# Altium schematic sheet Controle.SchDoc
size A4; SheetNumber: 2; SheetTotal: 4
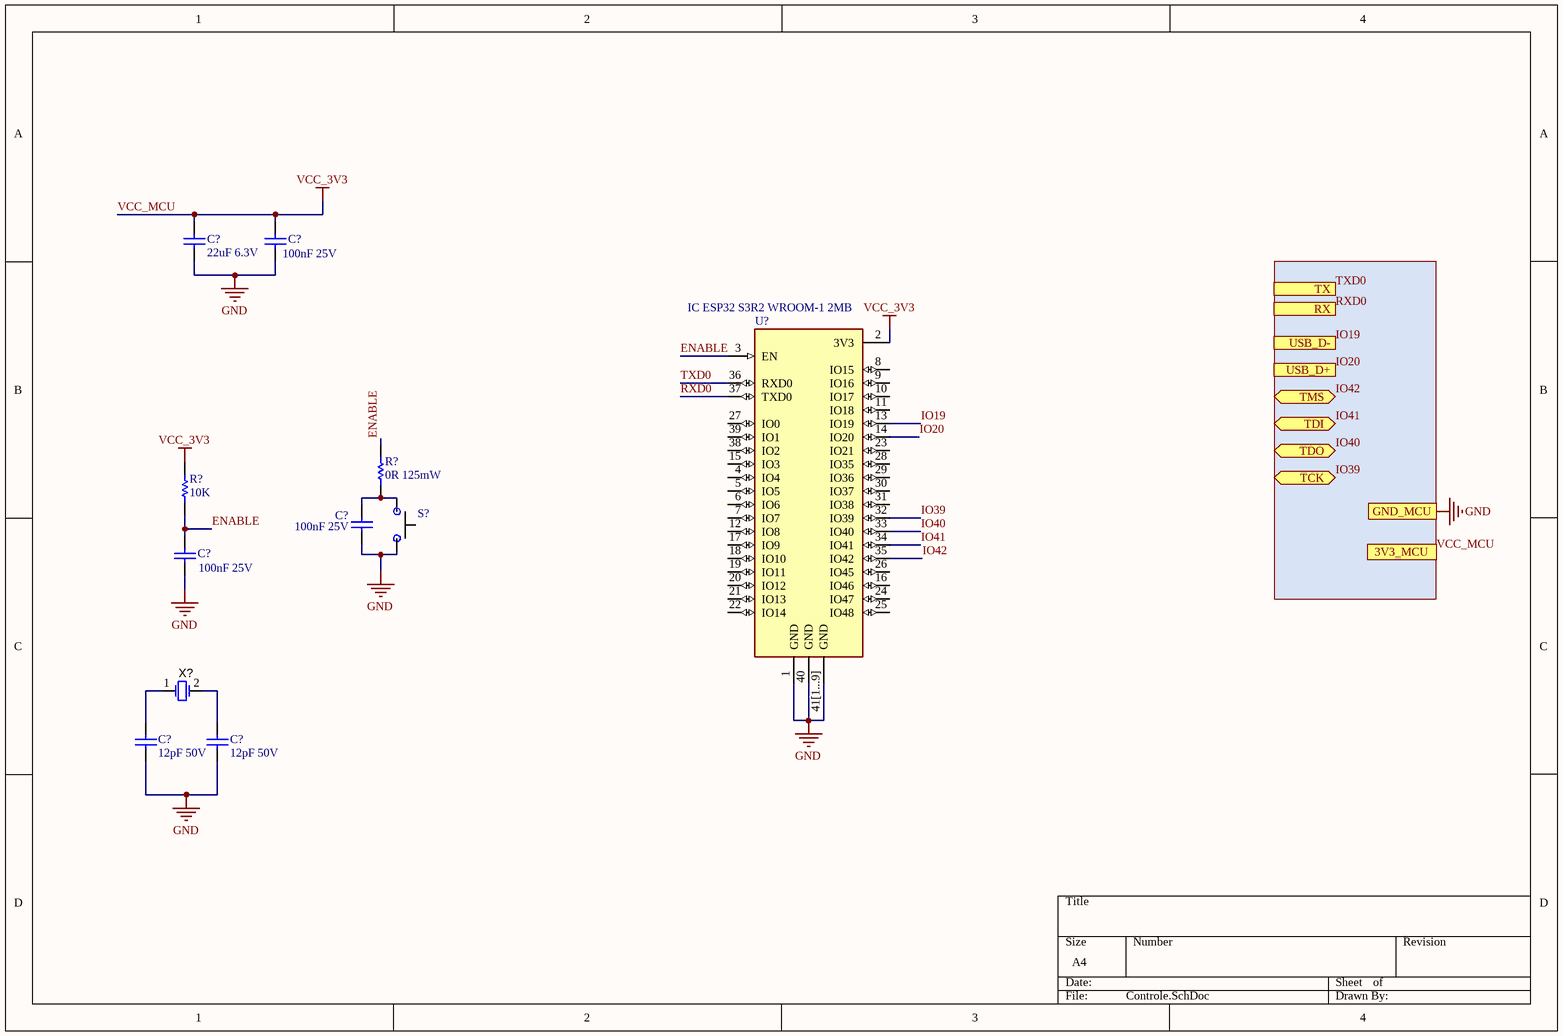
[diagram p0: Controle.SchDoc]

## Parts
(Parts that share a designator on the sheet are numbered #1, #2 ... from top to bottom, then left to right.)
C?#1  22uF 6.3V  [CC2012-0805]
C?#2  100nF 25V  [CC2012-0805]
C?#3  100nF 25V  [CC2012-0805]
C?#4  100nF 25V  [CC2012-0805]
C?#5  12pF 50V  [CC1005-0402]
C?#6  12pF 50V  [CC1005-0402]
R?#1  0R 125mW  [RESC2013X50X35ML15T15]
R?#2  10K  [CR1608-0603]
S?  SWITCH TACTILE SPST-NO 0.05A 12V SMD  [SWITCH_TACTILE_SMD_2PIN]  (value not drawn)
U?  IC ESP32 S3R2 WROOM-1 2MB  [ESP32_S3_WROOM_1]
X?  ABS07-32.768KHz-T  [ABRA-ABS07-2_V]  (value not drawn)

## Ports
3V3_MCU, GND_MCU, RX (in), TCK (bidir), TDI (bidir), TDO (bidir), TMS (bidir), TX (out), USB_D+, USB_D-

## Nets
GND: C?#1.1 C?#2.1 C?#3.1 C?#4.1 C?#5.1 C?#6.1 S?.1 U?.1(GND) U?.40(GND) U?.41[1...9](GND) ; port GND_MCU
VCC_MCU: C?#1.2 C?#2.2 R?#2.2 U?.2(3V3) ; port 3V3_MCU  [also labelled VCC_3V3]
ENABLE: C?#4.2 R?#1.2 R?#2.1 U?.3(EN)
IO19: U?.13(IO19) ; port USB_D-
IO20: U?.14(IO20) ; port USB_D+
IO39: U?.32(IO39) ; port TCK
IO40: U?.33(IO40) ; port TDO
IO41: U?.34(IO41) ; port TDI
IO42: U?.35(IO42) ; port TMS
RXD0: U?.37(TXD0) ; port RX
TXD0: U?.36(RXD0) ; port TX
NetC?#3_2: C?#3.2 R?#1.1 S?.2
NetC?#5_2: C?#5.2 X?.1(OSC1)
NetC?#6_2: C?#6.2 X?.2(OSC2)

Not connected (* = marked no-connect by the designer): U? 4(IO4) 5(IO5) 6(IO6) 7(IO7) 8(IO15) 9(IO16) 10(IO17) 11(IO18) 12(IO8) 15(IO3) 16(IO46) 17(IO9) 18(IO10) 19(IO11) 20(IO12) 21(IO13) 22(IO14) 23(IO21) 24(IO47) 25(IO48) 26(IO45) 27(IO0) 28(IO35) 29(IO36) 30(IO37) 31(IO38) 38(IO2) 39(IO1)

## Library data of the parts
C?#1 = CAP CER 22uF 6V3 0805 SMD: CAP CER 22UF 6.3V X5R 0805; Manufacturer: Samsung; Manufacturer Part Number: CL21A226KQQNNNE; Tolerance: 10%; Supplier 1: Avnet; RoHS: Yes; Category: Ceramic Capacitors; Stock 1: 46000; Pricing 1: 2000=0,02660, 4000=0,02622, 8000=0,02546, 12000=0,02489, 16000=0,02394 (USD); Mount: Surface Mount; Case/Package: 0805; Case Code (Metric): 2012; Case Code (Imperial): 0805; Min Operating Temperature: -55°C; Max Operating Temperature: 85°C; Package Quantity: 1; Packaging: Tape and Reel; Capacitance: 22uF; Voltage Rating: 6.3V; Voltage Rating (DC): 6.3V; Dielectric: X5R; Series: CL; Length: 0.079inch; Width: 0.049inch; Thickness: 0.055inch; Depth: 1.25mm; Radiation Hardening: No; RoHS Compliant: Yes; Lead Free: Lead Free; ComponentLink1URL: https://datasheet.ciiva.com/25796/cl21a226kqqnnne-25796131.pdf?src-supplier=Digi-Key; ComponentLink1Description: https://datasheet.ciiva.com/25796/cl21a226kqqnnne-25796131.pdf?src-supplier=Digi-Key; ComponentLink2URL: https://datasheet.ciiva.com/26838/getdatasheetpartid-353272-26838608.pdf?src-supplier=Verical; ComponentLink2Description: https://datasheet.ciiva.com/26838/getdatasheetpartid-353272-26838608.pdf?src-supplier=Verical; Supplier Part Number 1: CL21A226KQQNNNE
C?#2-C?#4 = CAP CER 0.1uF 25V 0805 SMD: Cap Ceramic 0.1uF 25V X7R 10% SMD 0805 125C Plastic T/R; Manufacturer: KEMET; Manufacturer Part Number: C0805C104K3RACTU; Supplier 1: RSComponents; RoHS: Yes; Category: Ceramic Capacitors; Stock 1: 1910; Pricing 1: 10=0,13300, 100=0,12200, 250=0,11000, 500=0,09400, 1000=0,08300 (USD); Mount: PCB,Surface Mount; Case/Package: 0805; Case Code (Imperial): 0805; Case Code (Metric): 2012; Dielectric Material: Ceramic; Contact Plating: Tin,Matte; Min Operating Temperature: -55°C; Max Operating Temperature: 125°C; Packaging: Tape and Reel; Tolerance: 10%; Capacitance: 100nF; Package Quantity: 4000; Voltage Rating: 25V; Series: C0805C; Voltage Rating (DC): 25V; Dielectric: X7R; Termination: SMD/SMT; Construction: Flat; Voltage: 25V; Length: 2mm; Width: 1.2mm; Height: 0.9mm; Depth: 1.25mm; Lead Pitch: 0.75mm; Radiation Hardening: No; RoHS Compliant: Yes; ComponentLink1URL: https://datasheet.ciiva.com/18193/getdatasheetpartid-385649-18193413.pdf?src-supplier=Verical; ComponentLink1Description: https://datasheet.ciiva.com/18193/getdatasheetpartid-385649-18193413.pdf?src-supplier=Verical; ComponentLink2URL: https://datasheet.ciiva.com/7842/kem-c1002-x7r-smd-7842536.pdf?src-supplier=Element14; ComponentLink2Description: https://datasheet.ciiva.com/7842/kem-c1002-x7r-smd-7842536.pdf?src-supplier=Element14; ComponentLink3URL: https://datasheet.ciiva.com/7842/kem-c1002-x7r-smd-7842538.pdf?src-supplier=Element14; ComponentLink3Description: https://datasheet.ciiva.com/7842/kem-c1002-x7r-smd-7842538.pdf?src-supplier=Element14; Supplier Part Number 1: 6480979
C?#5 C?#6 = CMP-004-000055-2: Ceramic capacitor SMD-0402 12pF /50V C0G# J +-5%, Samsung, RoHS; Manufacturer: Samsung Electro-Mechanics; Part#: CL05C120JB5NNNC; eVendor: LCSC; Temperature Coefficient: 300ppm/°C; eVendor#: C26406; Tolerance: 5%; Dielectric: C0G; eVendorPrice: 0,0037; ComponentLink1Description: https://datasheet.ciiva.com/25806/cl05c120jb5nnnc-25806484.pdf?src-supplier=Digi-Key; Construction: Flat; Package Quantity: 1; Depth: 0.5mm; Material: Ceramic; ComponentLink3Description: https://datasheet.ciiva.com/29198/458703-da-01-en-vs-kondensator-0402-29198421.pdf?src-supplier=Conrad; RoHS Compliant: Yes; Case Code (Metric): 1005; Length: 1mm; Series: CL; ComponentLink2Description: https://datasheet.ciiva.com/26838/getdatasheetpartid-658047-26838280.pdf?src-supplier=Verical; Source: mits.SchLib; Width: 0.02inch; Lead Free: Lead Free; Design Item ID: CAP CER 12pF 50V 5% NP0 0402 SMD; ComponentLink2URL: https://datasheet.ciiva.com/26838/getdatasheetpartid-658047-26838280.pdf?src-supplier=Verical; ComponentLink3URL: https://datasheet.ciiva.com/29198/458703-da-01-en-vs-kondensator-0402-29198421.pdf?src-supplier=Conrad; Case/Package: 0402; ComponentLink4URL: https://datasheet.ciiva.com/16449/cl05b104kq5nnnc-16449055.pdf?src-supplier=Future+Electronics; RoHS: Yes; Packaging: Tape and Reel; Voltage Rating: 50V; Voltage Rating (DC): 50V; Contact Plating: Tin; ComponentLink1URL: https://datasheet.ciiva.com/25806/cl05c120jb5nnnc-25806484.pdf?src-supplier=Digi-Key; Stock 1: 135300; Capacitance: 12pF; MOQ: 8690; Pricing 1: 100=0,00410, 1000=0,00310, 3000=0,00290, 10000=0,00270, 50000=0,00260, 100000=0,00260, 100=0,00390, 1000=0,00300, 3000=0,00280, 10000=0,00260, 50000=0,00250, 100000=0,00250, 100=0,02040, 1000=0,01580, 3000=0,01450, 10000=0,01380, 50000=0,01310, 100000=0,01310, 100=0,01960, 1000=0,01520, 3000=0,01390, 10000=0,01330, 50000=0,01260, 100000=0,01260, 100=0,00260, 1000=0,00200, 3000=0,00190, 10000=0,00180, 50000=0,00170, 100000=0,00170, 100=0,00230, 1000=0,00170, 3000=0,00160, 10000=0,00150, 50000=0,00150, 100000=0,00150, 100=0,02410, 1000=0,01870, 3000=0,01710, 10000=0,01630, 50000=0,01550, 100000=0,01550, 100=0,34060, 1000=0,26370, 3000=0,24170, 10000=0,23070, 50000=0,21970, 100000=0,21970, 100=0,01280, 1000=0,00990, 3000=0,00910, 10000=0,00870, 50000=0,00830, 100000=0,00830, 100=0,23450, 1000=0,18160, 3000=0,16640, 10000=0,15890, 50000=0,15130, 100000=0,15130, 100=0,02690, 1000=0,02080, 3000=0,01910, 10000=0,01820, 50000=0,01740, 100000=0,01740, 100=0,00420, 1000=0,00320, 3000=0,00300, 10000=0,00280, 50000=0,00270, 100000=0,00270, 100=0,00310, 1000=0,00240, 3000=0,00220, 10000=0,00210, 50000=0,00200, 100000=0,00200 (AUD); Category: Ceramic Capacitors; Max Operating Temperature: 125°C; Case Code (Imperial): 0402; Min Operating Temperature: -55°C; Thickness: 0.022inch; Manufacturer Part Number: CL05C120JB5NNNC; ComponentLink4Description: https://datasheet.ciiva.com/16449/cl05b104kq5nnnc-16449055.pdf?src-supplier=Future+Electronics; Radiation Hardening: No; Mount: Surface Mount; Voltage: 50V; Height: 0.5mm
R?#1 = CMP-009-00001-6: Chip Resistor, 0 Ohm, +/- 1%, 125 mW, -55 to 155 degC, 0805 (2012 Metric); Voltage Rating: 150V; Value: 0; Case/Package: 0805; Power: 125mW; Tolerance: 1%; Pins: 2; Mounting Technology: SM; Max Operating Temperature: 155°C; Min Operating Temperature: -55°C; RoHS Compliant: True
R?#2 = CMP-018-000030-1: RES 0805 10K Ohm 0.1% 1/8W  SMD; Manufacturer Part Number: ERJ-6ENF1002V; Manufacturer: Panasonic Electronic Components; Number of Resistors: 1; Voltage Rating (DC): 150V; Max Power Dissipation: 125mW; Temperature Coefficient: ±100ppm/°C; Tolerance: ±1%; Power: 0.125W, 1/8W; ComponentLink6URL: https://datasheet.ciiva.com/16725/70260748-16725031.pdf?src-supplier=Allied+Electronics; Package / Case: 0805 (2012 Metric); Supplier Device Package: 0805; Resistance (Ohms): 10k; ComponentLink14Description: https://datasheet.ciiva.com/24440/eng-ds-1773270-l-24440188.pdf?src-supplier=Onlinecomponents.com; Operating Temperature: -55°C ~ 155°C; ComponentLink15Description: https://datasheet.ciiva.com/7731/eng-ds-1773270-l-7731311.pdf?src-supplier=Element14; ComponentLink7Description: https://datasheet.ciiva.com/46372/1678782-46372714.pdf?src-supplier=Element14; ComponentLink13Description: https://datasheet.ciiva.com/16723/70063741-16723029.pdf?src-supplier=Allied+Electronics; Contact Plating: Tin; Part Status: Active; ComponentLink11Description: https://datasheet.ciiva.com/30140/aoa0000ce2-30140236.pdf?src-supplier=Onlinecomponents.com; ComponentLink6Description: https://datasheet.ciiva.com/16725/70260748-16725031.pdf?src-supplier=Allied+Electronics; Lead Free: Lead Free; ComponentLink14URL: https://datasheet.ciiva.com/24440/eng-ds-1773270-l-24440188.pdf?src-supplier=Onlinecomponents.com; Design Item ID: RES 10K OHM 1% 1/8W 0805 SMD; ComponentLink7URL: https://datasheet.ciiva.com/46372/1678782-46372714.pdf?src-supplier=Element14; ComponentLink3Description: https://datasheet.ciiva.com/16514/aoa0000ce2-16514021.pdf?src-supplier=Avnet+Asia; Category: Resistors; ComponentLink13URL: https://datasheet.ciiva.com/16723/70063741-16723029.pdf?src-supplier=Allied+Electronics; Case Code (Imperial): 0805; Failure Rate: -; Stock 1: 2392770; ComponentLink5URL: https://datasheet.ciiva.com/16759/70260748-16759350.pdf?src-supplier=Allied+Electronics; Features: Automotive AEC-Q200; ComponentLink12URL: https://datasheet.ciiva.com/24070/aoa0000ce2-24070702.pdf?src-supplier=Mouser; ComponentLink9URL: https://datasheet.ciiva.com/7830/426256-7830745.pdf?src-supplier=Element14; Termination: SMD/SMT; ComponentLink10Description: https://datasheet.ciiva.com/17212/aoa0000ce2-17212108.pdf?src-supplier=Avnet+Europe; Length: 2mm; ComponentLink15URL: https://datasheet.ciiva.com/7731/eng-ds-1773270-l-7731311.pdf?src-supplier=Element14; ComponentLink8Description: https://datasheet.ciiva.com/46372/1678782-46372715.pdf?src-supplier=Element14; ComponentLink11URL: https://datasheet.ciiva.com/30140/aoa0000ce2-30140236.pdf?src-supplier=Onlinecomponents.com; Size / Dimension: 0.079" L x 0.049" W (2.00mm x 1.25mm); ComponentLink9Description: https://datasheet.ciiva.com/7830/426256-7830745.pdf?src-supplier=Element14; REACH SVHC: No SVHC; Source: mits.SchLib; Military Standard: Not; ComponentLink5Description: https://datasheet.ciiva.com/16759/70260748-16759350.pdf?src-supplier=Allied+Electronics; ComponentLink1Description: https://industrial.panasonic.com/cdbs/www-data/pdf/RDA0000/AOA0000C283.pdf; ComponentLink16URL: https://datasheet.ciiva.com/14181/jcrn73-data-e-14181423.pdf?src-supplier=Distrelec; Stock 2: 1650; Working Voltage: 150V; ComponentLink8URL: https://datasheet.ciiva.com/46372/1678782-46372715.pdf?src-supplier=Element14; ComponentLink10URL: https://datasheet.ciiva.com/17212/aoa0000ce2-17212108.pdf?src-supplier=Avnet+Europe; Number of Pins: 2; Height: 0.6mm; ComponentLink4Description: https://datasheet.ciiva.com/27055/1988971-27055733.pdf?src-supplier=Jameco; ComponentLink4URL: https://datasheet.ciiva.com/27055/1988971-27055733.pdf?src-supplier=Jameco; Pricing 2: 1=1,68000, 10=1,48900, 100=1,13720, 1000=0,73645 (USD); Radiation Hardening: No; ComponentLink16Description: https://datasheet.ciiva.com/14181/jcrn73-data-e-14181423.pdf?src-supplier=Distrelec; Pricing 1: 1=0.1, 10=0.036, 25=0.0264, 50=0.02, 100=0.0148, 250=0.01124, 500=0.009, 1000=0.00663 (USD); ELV: Compliant; Width: 0.049inch; RoHS: RoHS Compliant; Number of Terminations: 2; ComponentLink2Description: https://datasheet.ciiva.com/11808/0900766b80f80784-11808080.pdf?src-supplier=RSComponents; Power Rating: 125mW; ComponentLink1URL: https://industrial.panasonic.com/cdbs/www-data/pdf/RDA0000/AOA0000C283.pdf; Mount: Surface Mount; Depth: 1.25mm; Case Code (Metric): 2012; ComponentLink12Description: https://datasheet.ciiva.com/24070/aoa0000ce2-24070702.pdf?src-supplier=Mouser; ComponentLink3URL: https://datasheet.ciiva.com/16514/aoa0000ce2-16514021.pdf?src-supplier=Avnet+Asia; ComponentLink2URL: https://datasheet.ciiva.com/11808/0900766b80f80784-11808080.pdf?src-supplier=RSComponents; Height - Seated (Max): 0.028" (0.70mm); Composition: Thick Film; Case/Package: 0805; Max Operating Temperature: 155°C; Packaging: Cut Tape (CT); Package Quantity: 5000; Voltage Rating: 150V; Min Operating Temperature: -55°C; Resistance: 10K
S? = CMP-019-000011-1: Switch Tactile N.O. SPST Rectangular Button J-Lead 0.05A 12VDC 2.55N SMD T/R; Manufacturer Part Number: TL3302BF260QJ; Manufacturer: E-Switch; Current Rating: 50mA; Operating Force: 260gf; Switch Travel: 0.25mm; Switch Function: Off-Mom; Actuator Material: Polyphenylene; Mechanical Life: 30000Cycles; Illumination Type: Non-Illuminated; ComponentLink1URL: https://datasheet.ciiva.com/2900/p020333b-2900880.pdf?src-supplier=Digi-Key; Design Item ID: SWITCH TACTILE SPST-NO 0.05A 12V SMD; Min Operating Temperature: -20°C; RoHS Compliant: Yes; Voltage Rating (DC): 12V; ComponentLink1Description: https://datasheet.ciiva.com/2900/p020333b-2900880.pdf?src-supplier=Digi-Key; Size: 11.4mm; Package Quantity: 1; Contact Plating: Silver; Lead Free: Lead Free; Termination: Gull Wing; Series: TL3302; Mount: Surface Mount; RoHS: Yes; Category: Tactile Switches; Stock 1: 19576; Throw Configuration: SPST; Packaging: Tape and Reel; Pricing 1: 1=0,82000, 10=0,79300, 25=0,74120, 100=0,64360, 250=0,58564, 500=0,54294 (USD); Source: mits.SchLib; Max Operating Temperature: 70°C
U? = IC ESP32 S3 WROOM-1_v2: SMD Module, ESP32-S3R2 With 2 mb; Manufacturer Part Number: ESP32-S3-WROOM-1-N8R2; MF: Espressif Systems; SnapEDA_Link: https://www.snapeda.com/parts/ESP32-S3-WROOM-1U/Espressif+Systems/view-part/?ref=snap; Availability: Not in stock; Package: Package; Price: None; Value: *; Check_prices: https://www.snapeda.com/parts/ESP32-S3-WROOM-1U/Espressif+Systems/view-part/?ref=eda; Supplier 1: Digi-Key; Manufacturer: Espressif Systems; RoHS: No; Category: Uncategorized; Stock 1: 659; Pricing 1: 1=3,63000 (USD)
X? = CMP-003-00022-2: Low Profile Crystal, 32.768 kHz, +/- 20 ppm, 12.5 pF, -40 to 85 degC, 2-Pin SMD, Pb-Free, Tape and Reel; Manufacturer: Abracon; Frequency Tolerance: 20ppm; ESR: 70k; Load Capacitance: 12.5pF; Max Operating Temperature: 85°C; Mounting Technology: SM; Manufacturer URL: http://www.abracon.com/; Pins: 2; Packaging: TapeandReel; Tolerance: 20ppm; Min Operating Temperature: -40°C; Frequency: 32.768kHz; Datasheet URL: http://www.abracon.com/Resonators/ABS07.pdf; RoHS Compliant: True; Package Description: 2-Pin Surface Mount Device, Body 3.2 x 1.5 mm; Datasheet Version: Aug-15; Package Reference: ABS07-2; Package URL: http://www.abracon.com/Support/PackageDrawing/Resonators/ABS07.PDF; Package Quantity: 3000; Case/Package: CSMD